# EAGLE design uhr (EAGLE 5.01)
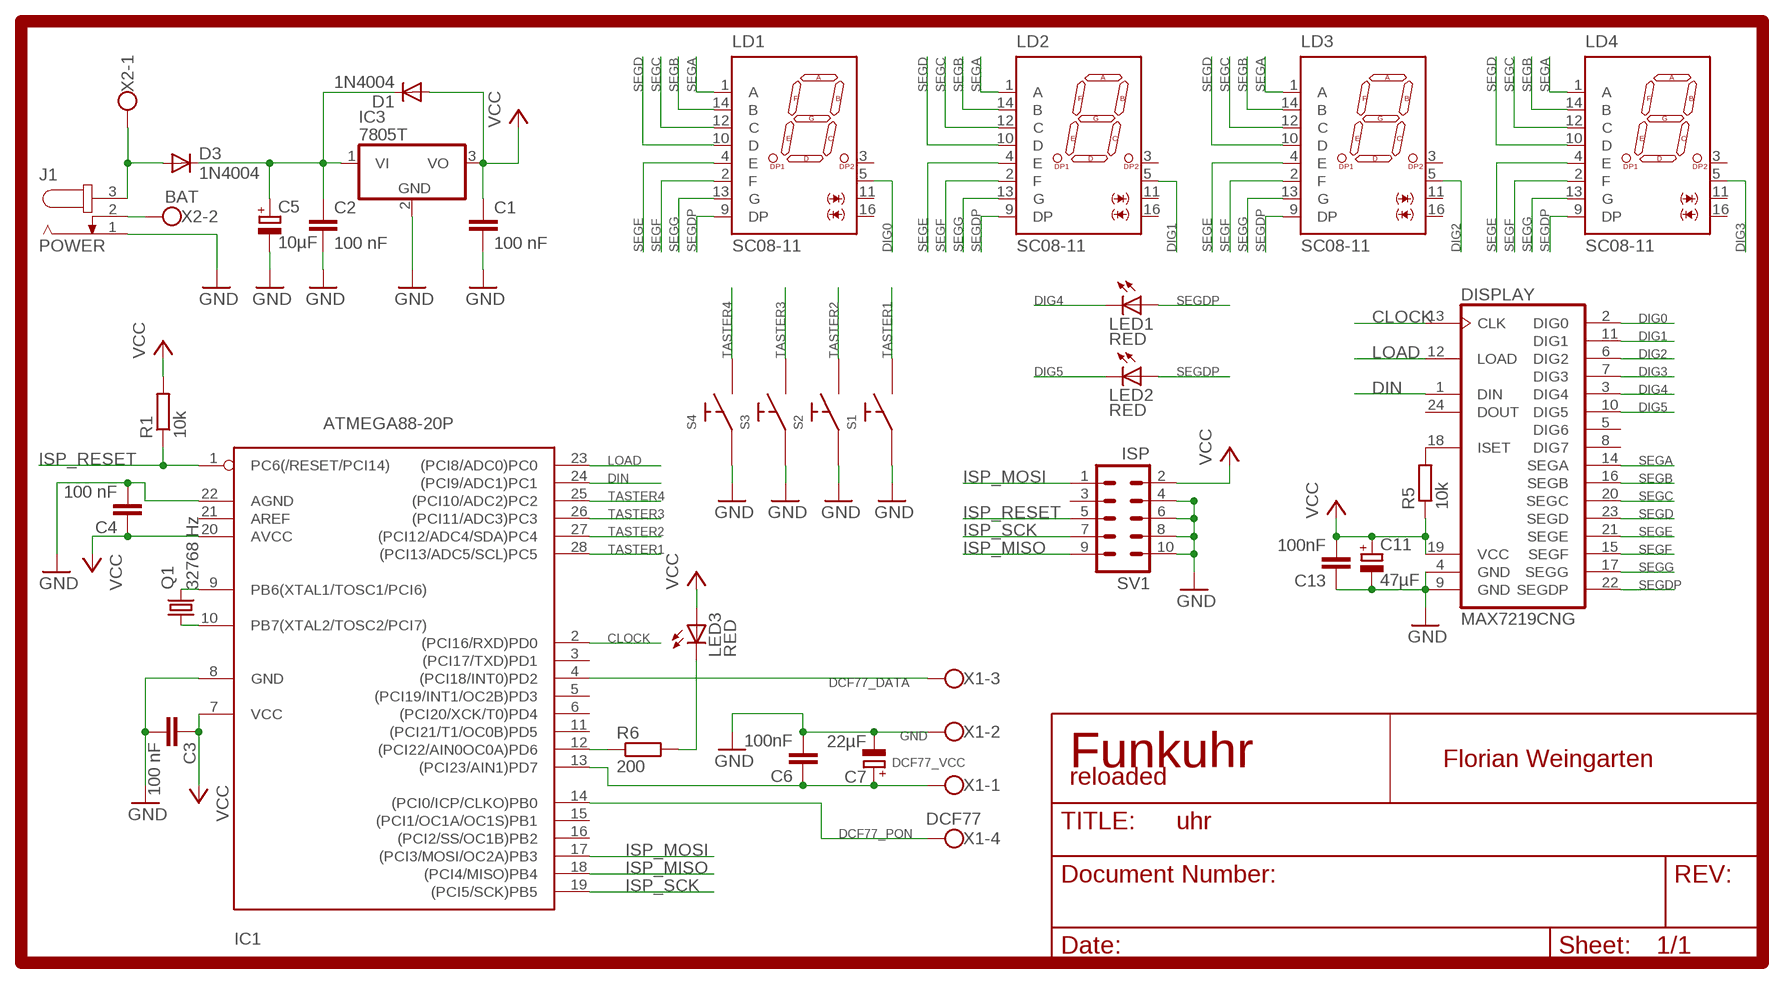
[diagram p0: schematic, sheet 1]

## Parts
C1  100 nF  C-EU025-024X044  [C025-024X044]
C2  100 nF  C-EU025-024X044  [C025-024X044]
C3  100 nF  C-EU025-024X044  [C025-024X044]
C4  100 nF  C-EU025-024X044  [C025-024X044]
C5  10µF  CPOL-EUE2-5  [E2-5]
C6  100nF  C-EU025-025X050  [C025-025X050]
C7  22µF  CPOL-EUE2,5-6E  [E2,5-6E]
C11  47µF  CPOL-EUE2-5  [E2-5]
C13  100nF  C-EU025-024X044  [C025-024X044]
D1  1N4004  DIODE-D-2.5  [D-2.5]
D3  1N4004  [DO41-10]
DISPLAY  MAX7219CNG  [DIL24-3]
IC1  ATMEGA88-20P  [DIL28-3]
IC3  7805T  [TO220H]
J1  POWER  JACK-PLUG1  [SPC4078]
LD1  SC08-11  [SA08]
LD2  SC08-11  [SA08]
LD3  SC08-11  [SA08]
LD4  SC08-11  [SA08]
LED1  RED  LED5MM  [LED5MM]
LED2  RED  LED5MM  [LED5MM]
LED3  RED  LED5MM  [LED5MM]
Q1  32768 Hz  CRYSTALTC26H  [TC26H]
R1  10k  R-EU_0207/10  [0207/10]
R5  10k  R-EU_0207/10  [0207/10]
R6  200  R-EU_0207/10  [0207/10]
S1  MIKROTASTER6X4H  [TASTER3305]
S2  MIKROTASTER6X4H  [TASTER3305]
S3  MIKROTASTER6X4H  [TASTER3305]
S4  MIKROTASTER6X4H  [TASTER3305]
SV1  ISP  ML10  [ML10]
X1  DCF77  W237-04P  [W237-4P]
X2  BAT  W237-102  [W237-102]

## Nets
CLOCK: DISPLAY.13(CLK) IC1.2((PCI16/RXD)PD0)
DCF77_DATA: IC1.4((PCI18/INT0)PD2) X1.3
DCF77_PON: IC1.14((PCI0/ICP/CLKO)PB0) X1.4
DCF77_VCC: C6.1 C7.+ IC1.13((PCI23/AIN1)PD7) X1.1
DIG0: DISPLAY.2(DIG0) LD1.5(AK)
DIG1: DISPLAY.11(DIG1) LD2.5(AK)
DIG2: DISPLAY.6(DIG2) LD3.5(AK)
DIG3: DISPLAY.7(DIG3) LD4.5(AK)
DIG4: DISPLAY.3(DIG4) LED1.K(C)
DIG5: DISPLAY.10(DIG5) LED2.K(C)
DIN: DISPLAY.1(DIN) IC1.24((PCI9/ADC1)PC1)
GND: C1.2 C2.2 C3.2 C4.2 C5.- C6.2 C7.- C11.- C13.1 DISPLAY.4(GND) DISPLAY.9(GND) IC1.8(GND) IC1.22(AGND) IC3.2(GND) J1.1 S1.1 S2.1 S3.1 S4.1 SV1.4 SV1.6 SV1.8 SV1.10 X1.2
ISP_MISO: IC1.18((PCI4/MISO)PB4) SV1.9
ISP_MOSI: IC1.17((PCI3/MOSI/OC2A)PB3) SV1.1
ISP_RESET: IC1.1(PC6(/RESET/PCI14)) R1.1 SV1.5
ISP_SCK: IC1.19((PCI5/SCK)PB5) SV1.7
LOAD: DISPLAY.12(LOAD) IC1.23((PCI8/ADC0)PC0)
N$1: IC1.9(PB6(XTAL1/TOSC1/PCI6)) Q1.2
N$2: DISPLAY.18(ISET) R5.2
N$3: IC1.10(PB7(XTAL2/TOSC2/PCI7)) Q1.1
N$6: IC1.12((PCI22/AIN0OC0A)PD6) R6.1
N$7: LED3.K(C) R6.2
N$12: C2.1 C5.+ D1.C D3.C IC3.1(VI)
N$18: J1.2 X2.2
N$20: D3.A J1.3 X2.1
SEGA: DISPLAY.14(SEGA) LD1.1(A) LD2.1(A) LD3.1(A) LD4.1(A)
SEGB: DISPLAY.16(SEGB) LD1.14(B) LD2.14(B) LD3.14(B) LD4.14(B)
SEGC: DISPLAY.20(SEGC) LD1.12(C) LD2.12(C) LD3.12(C) LD4.12(C)
SEGD: DISPLAY.23(SEGD) LD1.10(D) LD2.10(D) LD3.10(D) LD4.10(D)
SEGDP: DISPLAY.22(SEGDP) LD1.9(DP) LD2.9(DP) LD3.9(DP) LD4.9(DP) LED1.A LED2.A
SEGE: DISPLAY.21(SEGE) LD1.4(E) LD2.4(E) LD3.4(E) LD4.4(E)
SEGF: DISPLAY.15(SEGF) LD1.2(F) LD2.2(F) LD3.2(F) LD4.2(F)
SEGG: DISPLAY.17(SEGG) LD1.13(G) LD2.13(G) LD3.13(G) LD4.13(G)
TASTER1: IC1.28((PCI13/ADC5/SCL)PC5) S1.2
TASTER2: IC1.27((PCI12/ADC4/SDA)PC4) S2.2
TASTER3: IC1.26((PCI11/ADC3)PC3) S3.2
TASTER4: IC1.25((PCI10/ADC2)PC2) S4.2
VCC: C1.1 C3.1 C4.1 C11.+ C13.2 D1.A DISPLAY.19(VCC) IC1.7(VCC) IC1.20(AVCC) IC3.3(VO) LED3.A R1.2 R5.1 SV1.2
Unconnected: DISPLAY.5(DIG6) DISPLAY.8(DIG7) DISPLAY.24(DOUT) IC1.3((PCI17/TXD)PD1) IC1.5((PCI19/INT1/OC2B)PD3) IC1.6((PCI20/XCK/T0)PD4) IC1.11((PCI21/T1/OC0B)PD5) IC1.15((PCI1/OC1A/OC1S)PB1) IC1.16((PCI2/SS/OC1B)PB2) IC1.21(AREF) LD1.3(AK) LD1.11(AK) LD1.16(AK) LD2.3(AK) LD2.11(AK) LD2.16(AK) LD3.3(AK) LD3.11(AK) LD3.16(AK) LD4.3(AK) LD4.11(AK) LD4.16(AK) SV1.3

## Notes on the sheet
- Funkuhr | Florian Weingarten
- reloaded

## Library data of the parts
C1-C4 C6 C13 = rcl:C-EU: CAPACITOR, European symbol
C5 C7 C11 = rcl:CPOL-EU: POLARIZED CAPACITOR, European symbol
D1 = diode:DIODE-: DIODE
D3 = diode:1N4004: DIODE general purpose rectifier, 1 A
DISPLAY = maxim:MAX7219CNG: LED DISPLAY DRIVER
IC1 = avr:ATMEGA88*P: MICROCONTROLLER 8 kBytes FLASH 1 kBytes SRAM 512 Bytes EEPROM USART 8-channel 10 bit ADC
IC3 = linear:78*: Positive VOLTAGE REGULATOR Source: http://cache.national.com/ds/LM/LM78L05.pdf http://www.fairchildsemi.com/ds/LM/LM7805.pdf
J1 = con-jack:JACK-PLUG: DC POWER JACK Power Jack, DC, Right Angle, Through Hole, Rated 5A at 16VDC, PC Terminals Distributor: Farnell (www.Farnell.de) Drawing: 84N1161.pdf / 84N1162.pdf Manufacturer: SPC Technology (www.spctechnology.com) Type: SPC4077 / SPC 4078
LD1-LD4 = led:S*08: Kingbright 20mm (0.8Inch) Single Digit Numeric Display Source: SA08-11SRWA.pdf
LED1-LED3 = led:LED: LED OSRAM: - CHIPLED LG R971, LG N971, LY N971, LG Q971, LY Q971, LO R971, LY R971 LH N974, LH R974 LS Q976, LO Q976, LY Q976 LO Q996 - Hyper CHIPLED LW Q18S LB Q993, LB Q99A, LB R99A - SideLED LS A670, LO A670, LY A670, LG A670, LP A670 LB A673, LV A673, LT A673, LW A673 LH A674 LY A675 LS A676, LA A676, LO A676, LY A676, LW A676 LS A679, LY A679, LG A679 - Hyper Micro SIDELED® LS Y876, LA Y876, LO Y876, LY Y876 LT Y87S - SmartLED LW L88C, LW L88S LB L89C, LB L89S, LG L890 LS L89K, LO L89K, LY L89K LS L896, LA L896, LO L896, LY L896 - TOPLED LS T670, LO T670, LY T670, LG T670, LP T670 LSG T670, LSP T670, LSY T670, LOP T670, LYG T670 LG T671, LOG T671, LSG T671 LB T673, LV T673, LT T673, LW T673 LH T674 LS T676, LA T676, LO T676, LY T676, LB T676, LH T676, LSB T676, LW T676 LB T67C, LV T67C, LT T67C, LS T67K, LO T67K, LY T67K, LW E67C LS E67B, LA E67B, LO E67B, LY E67B, LB E67C, LV E67C, LT E67C LW T67C LS T679, LY T679, LG T679 LS T770, LO T770, LY T770, LG T770, LP T770 LB T773, LV T773, LT T773, LW T773 LH T774 LS E675, LA E675, LY E675, LS T675 LS T776, LA T776, LO T776, LY T776, LB T776 LHGB T686 LT T68C, LB T68C - Hyper Mini TOPLED® LB M676 - Mini TOPLED Santana® LG M470 LS M47K, LO M47K, LY M47K Source: http://www.osram.convergy.de - LUMILED® LXK2-PW12-R00, LXK2-PW12-S00, LXK2-PW14-U00, LXK2-PW14-V00 LXK2-PM12-R00, LXK2-PM12-S00, LXK2-PM14-U00 LXK2-PE12-Q00, LXK2-PE12-R00, LXK2-PE12-S00, LXK2-PE14-T00, LXK2-PE14-U00 LXK2-PB12-K00, LXK2-PB12-L00, LXK2-PB12-M00, LXK2-PB14-N00, LXK2-PB14-P00, LXK2-PB14-Q00 LXK2-PR12-L00, LXK2-PR12-M00, LXK2-PR14-Q00, LXK2-PR14-R00 LXK2-PD12-Q00, LXK2-PD12-R00, LXK2-PD12-S00 LXK2-PH12-R00, LXK2-PH12-S00 LXK2-PL12-P00, LXK2-PL12-Q00, LXK2-PL12-R00 Source: www.luxeon.com
Q1 = crystal:CRYSTAL: CRYSTAL
R1 R5 R6 = resistor:R-EU_: RESISTOR, European symbol
S1-S4 = reichelt:MIKROTASTER
SV1 = con-ml:ML10: HARTING
X1 = con-wago-508:W237-04P: WAGO SREW CLAMP
X2 = con-wago-500:W237-102: WAGO SCREW CLAMP

## Board
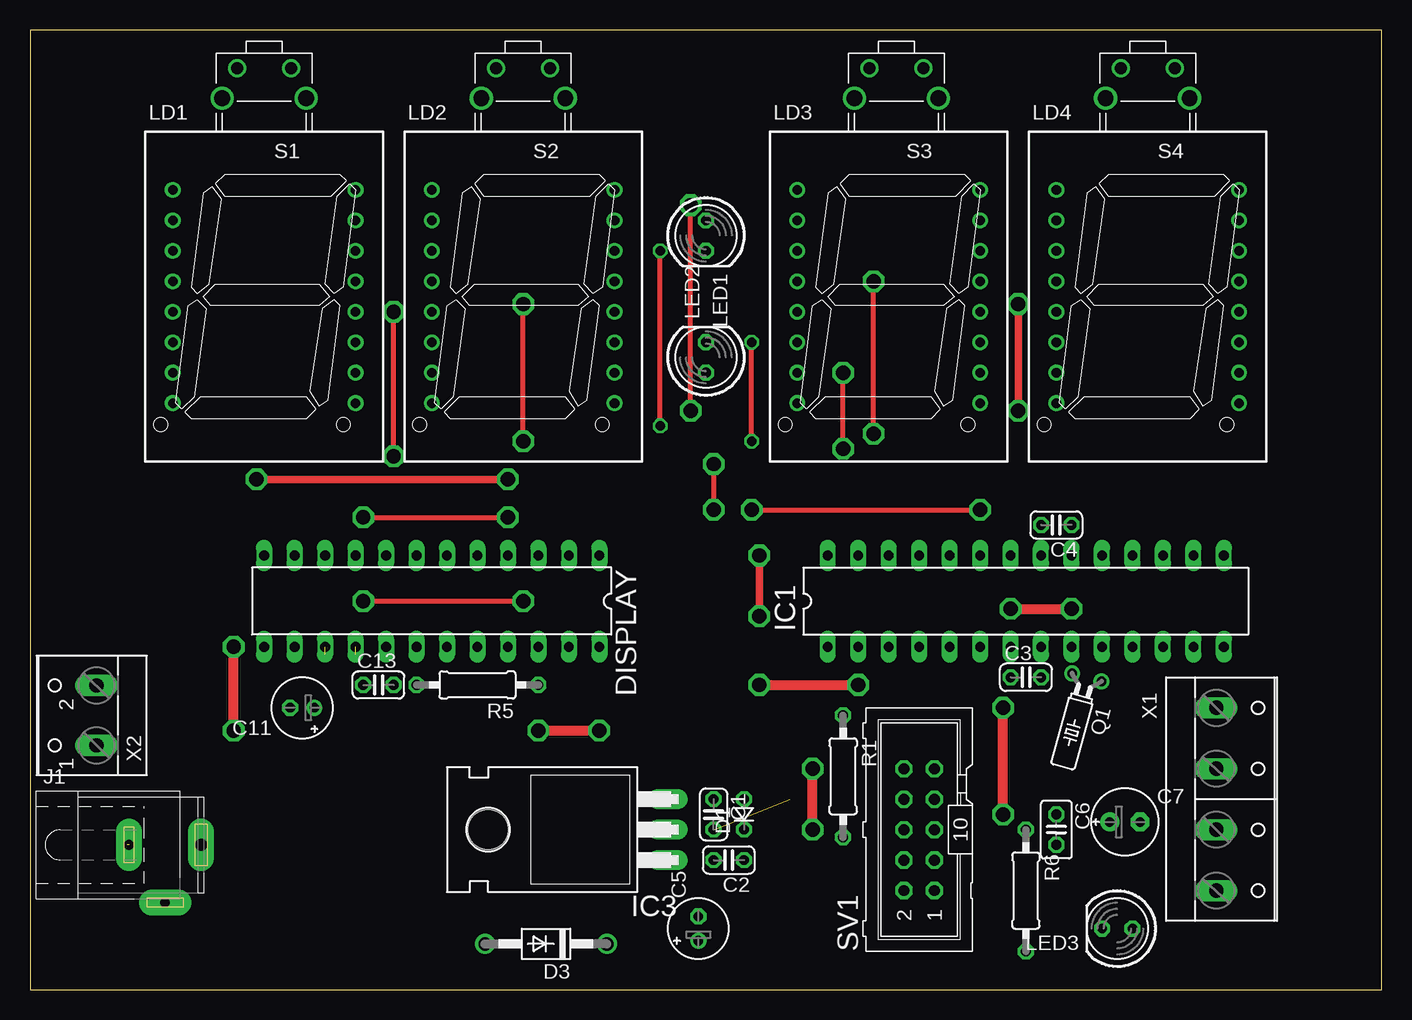
[diagram p1: board, top side]
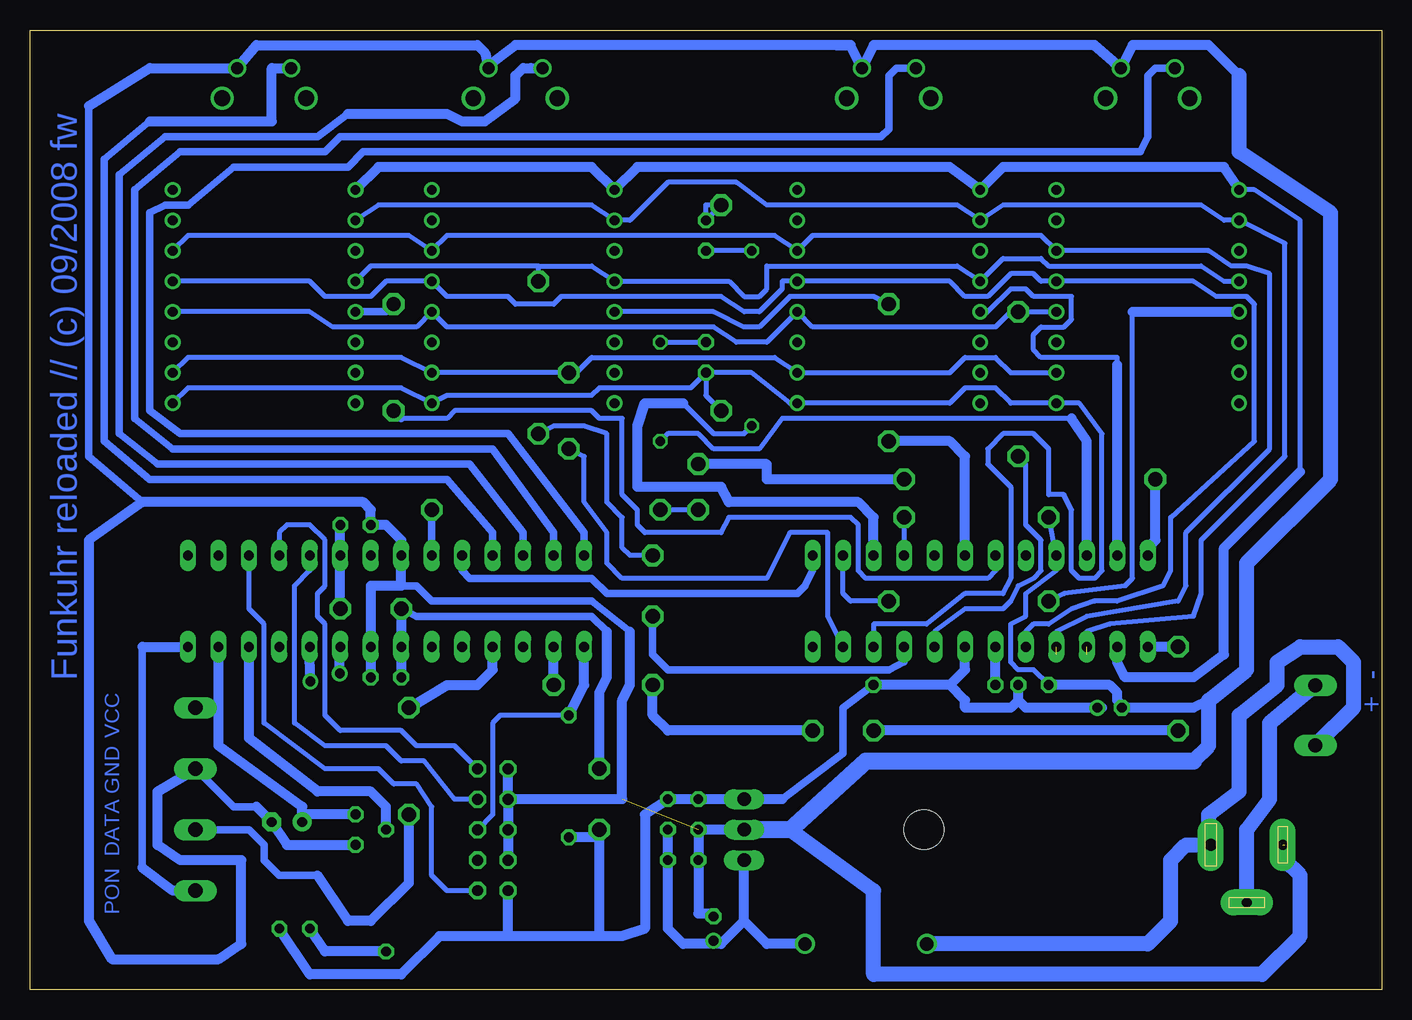
[diagram p2: board, bottom side, seen from below]

Size 112.7 x 80 mm. Coordinates in mm from the lower left corner, seen from the top.
Outline: 0,0 112.7,0 112.7,80 0,80 0,0
Copper layers (1*16): Top 0.035mm / dielectric 1.5mm / Bottom 0.035mm
Design rules "default": minimum track width 10mil, minimum drill 24mil, track to track 8mil, track to pad 8mil, pad to pad 8mil, via to via 8mil, smd to smd 8mil, copper to edge 40mil, drill to drill 8mil, minimum pad ring 10mil, minimum via ring 8mil, stop-mask expansion 4mil, vias tented up to drill 0mil, thermal gap 10mil

### Footprints (pad centres in the part's own frame; a part is rotated, then mirrored left to right if it is on the bottom)
C025-024X044 = drill 0.813 octagon: 1 -1.27,0; 2 1.27,0
E2-5 = drill 0.813 pad 1.27 round: + -1.016,0 | drill 0.813 pad 1.27 octagon: - 1.016,0
C025-025X050 = drill 0.813 octagon: 1 -1.27,0; 2 1.27,0
E2,5-6E = drill 0.813 pad 1.575 round: + -1.27,0 | drill 0.813 pad 1.575 octagon: - 1.27,0
D-2.5 = drill 0.813 octagon: A 1.27,0; C -1.27,0
DO41-10 = drill 1.118 round: A 5.08,0; C -5.08,0
DIL24-3 = drill 0.813 long: 1 -13.97,-3.81; 2 -11.43,-3.81; 3 -8.89,-3.81; 4 -6.35,-3.81; 5 -3.81,-3.81; 6 -1.27,-3.81; 7 1.27,-3.81; 8 3.81,-3.81; 9 6.35,-3.81; 10 8.89,-3.81; 11 11.43,-3.81; 12 13.97,-3.81; 13 13.97,3.81; 14 11.43,3.81; 15 8.89,3.81; 16 6.35,3.81; 17 3.81,3.81; 18 1.27,3.81; 19 -1.27,3.81; 20 -3.81,3.81; 21 -6.35,3.81; 22 -8.89,3.81; 23 -11.43,3.81; 24 -13.97,3.81
DIL28-3 = drill 0.813 long: 1 -16.51,-3.81; 2 -13.97,-3.81; 3 -11.43,-3.81; 4 -8.89,-3.81; 5 -6.35,-3.81; 6 -3.81,-3.81; 7 -1.27,-3.81; 8 1.27,-3.81; 9 3.81,-3.81; 10 6.35,-3.81; 11 8.89,-3.81; 12 11.43,-3.81; 13 13.97,-3.81; 14 16.51,-3.81; 15 16.51,3.81; 16 13.97,3.81; 17 11.43,3.81; 18 8.89,3.81; 19 6.35,3.81; 20 3.81,3.81; 21 1.27,3.81; 22 -1.27,3.81; 23 -3.81,3.81; 24 -6.35,3.81; 25 -8.89,3.81; 26 -11.43,3.81; 27 -13.97,3.81; 28 -16.51,3.81
TO220H = drill 1.118 long: 1 -2.54,-10.16; 2 0,-10.16; 3 2.54,-10.16 | hole 3.302: 0,4.826
SPC4078 = drill 0.8 pad 2.184 long: 1 -3,0; 2 0,-4.8 | drill 1 pad 2.184 long: 3 3,0
SA08 = drill 0.8 pad 1.27 round: 1 -7.62,8.89; 2 -7.62,6.35; 3 -7.62,3.81; 4 -7.62,1.27; 5 -7.62,-1.27; 6 -7.62,-3.81; 7 -7.62,-6.35; 8 -7.62,-8.89; 9 7.62,-8.89; 10 7.62,-6.35; 11 7.62,-3.81; 12 7.62,-1.27; 13 7.62,1.27; 14 7.62,3.81; 15 7.62,6.35; 16 7.62,8.89
LED5MM = drill 0.813 octagon: A -1.27,0; K 1.27,0
TC26H = drill 0.813 round: 1 -1.27,0; 2 1.27,0
0207/10 = drill 0.813 octagon: 1 -5.08,0; 2 5.08,0
TASTER3305 = drill 1 round: 1 -2.25,-1.25; 2 2.25,-1.25 | drill 1.3 round: 3 3.5,1.25; 4 -3.5,1.25
ML10 = drill 0.914 octagon: 1 -5.08,-1.27; 2 -5.08,1.27; 3 -2.54,-1.27; 4 -2.54,1.27; 5 0,-1.27; 6 0,1.27; 7 2.54,-1.27; 8 2.54,1.27; 9 5.08,-1.27; 10 5.08,1.27
W237-4P = drill 1.194 long: 1 -7.62,-0.635; 2 -2.54,-0.635; 3 2.54,-0.635; 4 7.62,-0.635
W237-102 = drill 1.194 long: 1 -2.5,-1.27; 2 2.5,-1.27

### Placement (x,y rotation side)
C1  56.98,14.6 270 top
C2  58.26,10.79 180 top
C3  83.02,26.03 0 top
C4  85.56,38.73 180 top
C5  55.71,5.08 90 top
C6  85.56,13.33 270 top
C7  91.28,13.97 0 top
C11  22.7,23.49 180 top
C13  29.04,25.39 0 top
D1  59.52,14.6 90 top
D3  43.02,3.8 180 top
DISPLAY  33.49,32.38 180 top
IC1  83.02,32.38 0 top
IC3  43.02,13.33 90 top
J1  11.27,12.06 0 top
LD1  19.52,57.78 0 top
LD2  41.11,57.78 0 top
LD3  71.59,57.78 0 top
LD4  93.18,57.78 0 top
LED1  56.35,62.86 270 top
LED2  56.35,52.7 90 top
LED3  90.64,5.08 180 top
Q1  88.1,26.03 164.8 top
R1  67.78,17.77 270 top
R5  37.3,25.39 180 top
R6  83.02,8.25 270 top
S1  19.52,75.56 180 top
S2  41.11,75.56 180 top
S3  72.23,75.56 180 top
S4  93.18,75.56 180 top
SV1  74.13,13.33 90 top
X1  99.53,15.87 270 top
X2  4.28,22.86 90 top

### Tracks (layer width: path | path; a pad name or v marks a point on that pad's centre or on a via)
CLOCK  (via drill 1.2 pad 0.61)
  Top 0.813: v16.98,21.58 v16.98,28.57 | v60.8,25.39 v69.05,25.39 | v42.38,21.58 v47.46,21.58
  Bottom 0.813: v69.05,25.39 IC1.2 | v16.98,21.58 v42.38,21.58 | v60.8,25.39 60.8,22.86 59.52,21.58 v47.46,21.58 | v16.98,28.57 DISPLAY.13
DCF77_DATA  (via drill 1.2 pad 1.78)
  Top 0.813: v81.12,14.6 v81.12,23.49
  Bottom 0.61: 88.73,9.52 91.91,9.52 93.18,10.79 93.18,12.06 94.45,13.33 X1.3
  Bottom 0.813: 88.73,9.52 86.2,5.71 84.29,5.71 81.12,8.89 v81.12,14.6 | v81.12,23.49 77.94,25.39 75.4,25.39 74.13,26.66 IC1.4
DCF77_PON
  Bottom 0.61: 103.34,10.16 103.34,28.57
  Bottom 0.813: 98.26,8.25 X1.4 100.8,8.25 103.34,10.16 | 103.34,28.57 IC1.14
DCF77_VCC
  Bottom 0.61: 96.99,23.49 X1.1
  Bottom 0.813: IC1.13 96.99,23.49 96.99,20.31 90.01,15.24 C7.+ 90.01,14.6 C6.1
DIG0  (via drill 1.2 pad 1.78)
  Top 0.406: v27.77,32.38 v41.11,32.38
  Bottom 0.406: DISPLAY.2 44.92,33.02 44.28,32.38 v41.11,32.38 | 20.79,56.51 20.79,34.29 21.43,33.65 26.5,33.02 v27.77,32.38
  Bottom 0.813: 20.79,56.51 LD1.5
DIG1
  Bottom 0.406: 22.06,52.07 22.06,52.7 28.41,52.7 29.04,53.34 29.04,54.61 28.41,55.24 26.5,55.24 25.87,55.88 25.87,57.78 29.04,57.78 29.68,58.41 30.95,58.41 32.86,56.51 LD2.5
  Bottom 0.813: DISPLAY.11 22.06,52.07
DIG2  (via drill 1.2 pad 0.61)
  Top 0.406: v41.11,45.72 v41.11,57.15
  Bottom 0.406: LD3.5 55.71,56.51 53.17,55.24 51.91,55.24 49.37,57.78 42.38,57.78 v41.11,57.15
  Bottom 0.813: v41.11,45.72 36.03,45.72 34.76,44.45 DISPLAY.6
DIG3  (via drill 1.2 pad 0.61)
  Top 0.61: v82.39,48.26 v82.39,57.15
  Bottom 0.406: DISPLAY.7 32.22,34.92 32.86,34.29 43.02,34.29 43.65,34.92 43.65,38.73 44.28,39.37 54.45,39.37 55.08,38.1 61.43,38.1 62.06,38.73 62.06,40 63.34,41.27 63.34,47.62 65.24,47.62 65.88,48.26 77.31,48.26 77.94,47.62 81.75,47.62
  Bottom 0.61: v82.39,57.15 83.02,56.51 LD4.5 | 81.75,47.62 v82.39,48.26
DIG4  (via drill 0.8)
  Top 0.406: v52.54,46.98 v52.54,61.59
  Bottom 0.406: 58.26,48.89 55.71,46.35 53.17,46.35 v52.54,46.98 | v52.54,61.59 LED1.K
  Bottom 0.813: DISPLAY.3 42.38,39.37 43.65,40.64 54.45,40.64 55.08,41.91 62.06,41.91 62.06,46.98 61.43,48.89 58.26,48.89
DIG5  (via drill 0.8)
  Top 0.406: v60.16,45.72 v60.16,53.97
  Bottom 0.406: v60.16,45.72 59.52,46.35 56.98,46.35 55.71,45.08 51.91,45.08 50,47.62 25.87,47.62 | v60.16,53.97 LED2.K
  Bottom 0.813: DISPLAY.10 24.6,45.72 25.87,47.62
DIN
  Bottom 0.61: IC1.24 76.67,34.92 76.04,34.29 65.88,34.29 64.61,33.02 48.73,33.02 48.09,33.65 47.46,34.92 DISPLAY.1
GND  (via drill 1.2 pad 0.61)  (2 unrouted)
  Top 0.406: v27.77,39.37 v39.84,39.37
  Bottom 0.254: 22.06,24.76 C11.- | 56.98,6.34 C5.- | IC3.2 53.81,13.97
  Bottom 0.406: C13.1 29.04,26.66 30.31,26.66 30.95,27.3 30.95,30.47 29.68,31.11 29.68,33.02 27.14,34.92 DISPLAY.9 v27.77,39.37 | v39.84,39.37 DISPLAY.4
  Bottom 0.61: 103.34,40.64 107.79,44.45 107.79,73.66 | 81.75,33.65 80.48,33.65 79.21,32.38 65.88,32.38 62.7,29.84 | 93.82,15.24 95.72,15.24 X1.2
  Bottom 0.813: C3.2 IC1.8 84.29,33.65 81.75,33.65 IC1.22 81.75,37.46 83.02,38.73 C4.2 84.29,40 84.93,40.64 103.34,40.64 107.79,37.46 107.79,5.71 105.88,2.54 96.99,2.54 95.09,3.8 95.09,10.79 100.17,10.79 102.07,12.06 102.07,16.5 X1.2 | 62.7,29.84 62.7,25.39 63.34,24.12 63.34,15.87 SV1.8 | 93.82,15.24 C7.- 91.28,12.06 C6.2 | C13.1 22.7,25.39 22.06,24.76 22.06,24.12 21.43,23.49 15.71,23.49 14.44,24.12 | 107.79,73.66 102.71,76.83 S4.1 93.82,78.73 75.4,78.73 74.77,78.1 S3.1 | IC3.2 C1.2 C2.2 56.98,6.34 55.71,6.34 | SV1.4 SV1.6 SV1.8 | SV1.8 SV1.10 | 44.28,78.73 S2.1 42.38,78.73 23.96,78.73 S1.1 20.79,78.73 14.44,78.73 11.9,76.19 | 74.77,76.83 72.23,78.73 44.28,78.73 | 45.55,78.73 44.28,78.73
  Bottom 1.27: 49.37,13.33 42.38,8.25 42.38,1.27 10,1.27 6.82,4.44 6.82,9.52 8.09,10.79 8.09,12.06 | 15.71,19.04 14.44,20.31 14.44,24.12 11.27,26.66 11.27,35.55 4.28,42.54 4.28,64.77 11.9,69.84 11.9,76.19
  Bottom 1.422: IC3.2 49.37,13.33 43.02,19.04 15.71,19.04
ISP_MISO
  Bottom 0.406: SV1.9 77.31,20.31 80.48,20.31 81.75,21.58 86.83,21.58 88.1,22.86 88.1,30.47 88.73,31.11 88.73,33.02 88.1,33.65 88.1,37.46 89.37,38.73 91.28,38.73 91.91,38.1 IC1.18
ISP_MOSI
  Bottom 0.406: SV1.1 77.94,8.25 79.21,9.52 79.21,15.24 80.48,17.14 82.39,17.14 83.66,18.41 88.1,18.41 93.18,22.22 93.18,30.47 94.45,31.74 IC1.17
ISP_RESET
  Bottom 0.406: SV1.5 74.13,14.6 74.13,22.22 73.5,22.86 R1.1
  Bottom 0.813: IC1.1 66.51,25.39 R1.1
ISP_SCK
  Bottom 0.406: SV1.7 77.31,15.87 79.85,19.04 81.75,19.04 83.02,20.31 88.1,20.31 90.64,22.22 90.64,33.65 89.37,34.92 IC1.19
LOAD  (via drill 1.2 pad 0.61)
  Top 0.406: v60.16,40 v79.21,40 | v56.98,43.81 v56.98,40
  Top 0.61: v18.89,42.54 v39.84,42.54
  Bottom 0.406: v56.98,40 v60.16,40
  Bottom 0.61: v79.21,40 IC1.23
  Bottom 0.813: v39.84,42.54 51.27,42.54 51.27,43.81 v56.98,43.81 | DISPLAY.12 19.52,36.83 18.89,37.46 v18.89,42.54
N$1
  Bottom 0.813: Q1.2 IC1.9
N$2
  Bottom 0.813: R5.2 DISPLAY.18
N$3
  Bottom 0.813: Q1.1 IC1.10
N$6
  Bottom 0.813: IC1.12 94.45,20.95 88.73,16.5 84.29,16.5 83.02,15.24 R6.1
N$7
  Bottom 0.813: LED3.K 88.1,3.17 R6.2
N$12
  Bottom 0.406: 55.71,3.8 C5.+
  Bottom 0.813: D1.C C2.1 59.52,5.08 58.26,3.8 55.71,3.8 55.08,3.8 53.17,5.71 | D3.C 51.27,3.8 53.17,5.71 | 53.17,5.71 IC3.1
N$18
  Bottom 1.27: J1.2 11.27,13.33 9.36,15.87 9.36,22.22 5.55,25.39 X2.2
N$20
  Bottom 1.27: 14.44,12.06 16.34,12.06 17.61,10.79 17.61,5.71 19.52,3.8 D3.A | X2.1 2.38,23.49 2.38,27.3 3.65,28.57 6.82,28.57 8.72,27.3 8.72,25.39 11.9,22.86 11.9,16.5 14.44,14.6 14.44,12.06 | 14.44,12.06 J1.3
SEGA
  Bottom 0.406: 6.82,43.18 6.82,64.13 10.63,66.67 LD1.1
  Bottom 0.813: LD1.1 13.17,68.57 31.59,68.57 LD2.1 36.03,68.57 62.06,68.57 LD3.1 65.88,68.57 83.66,68.57 LD4.1 | 6.82,43.18 13.17,36.83 13.17,27.93 15.71,26.03 21.43,26.03 22.06,27.3 DISPLAY.14
SEGB  (1 unrouted)
  Bottom 0.406: LD4.14 99.53,62.86 81.12,62.86 LD3.14 77.94,62.86 50.63,62.86 LD2.14 47.46,62.86 28.41,62.86 LD1.14 14.44,61.59 12.54,60.32 11.27,60.32 9.36,59.69 9.36,45.08 16.34,38.1 16.34,33.65 16.98,32.38 24.6,31.11 27.14,29.84 27.14,27.93
SEGC  (via drill 1.2 pad 1.78)
  Top 0.406: v30.31,44.45 v30.31,56.51
  Bottom 0.406: LD1.12 v30.31,56.51 30.95,56.51 32.22,55.24 47.46,55.24 LD2.12 51.27,53.97 53.81,53.97 55.71,55.24 77.94,55.24 LD3.12 80.48,55.24 87.47,55.24 89.37,56.51 LD4.12 | DISPLAY.20 37.3,29.84 34.76,31.74 31.59,31.74 30.95,32.38 30.31,33.65 29.04,34.29 28.41,34.92 28.41,37.46 29.68,38.73 29.68,43.81 v30.31,44.45
SEGD  (via drill 1.2 pad 0.61)
  Top 0.406: v67.78,45.08 v67.78,51.43
  Bottom 0.406: LD1.10 30.95,51.43 32.22,52.7 34.76,52.7 36.03,51.43 LD2.10 50.63,52.7 65.88,52.7 67.14,51.43 v67.78,51.43 LD3.10 81.75,52.7 99.53,52.7 LD4.10 | DISPLAY.23 46.19,31.11 46.19,38.1 49.37,38.1 51.27,34.29 63.34,34.29 64.61,35.55 64.61,38.1 66.51,40.64 66.51,44.45 v67.78,45.08
SEGDP  (via drill 1.2 pad 1.78)
  Top 0.406: v55.08,48.26 v55.08,65.4
  Bottom 0.406: LD4.9 99.53,50.16 81.75,50.16 LD3.9 77.94,49.53 65.88,49.53 65.24,50.16 57.62,50.16 LED2.A | LED2.A 52.54,51.43 49.37,48.89 LD2.9 36.03,48.89 34.76,50.16 32.22,50.16 30.95,48.89 LD1.9 25.23,48.89 23.33,46.35 23.33,34.92 23.96,34.29 25.23,34.29 25.87,34.92 25.87,40 26.5,41.27 27.77,41.27 27.77,45.08 29.04,46.35 31.59,46.35 32.86,45.08 32.86,43.81 30.95,41.91 30.95,34.29 31.59,33.02 34.76,33.02 37.94,30.47 42.38,30.47 DISPLAY.22 | v55.08,48.26 56.35,49.53 LED2.A | v55.08,65.4 LED1.A 56.35,65.4 v55.08,65.4
SEGE  (via drill 1.2 pad 0.61)
  Top 0.406: v70.32,46.35 v70.32,59.05
  Top 0.61: v60.8,31.11 v60.8,36.19
  Bottom 0.406: LD1.4 13.17,59.05 15.07,60.32 27.77,60.32 28.41,60.96 31.59,60.96 LD2.4 35.4,60.32 51.27,60.32 51.27,58.41 51.91,57.78 53.17,57.78 54.45,59.05 LD3.4 65.88,60.32 70.32,60.32 | 70.32,60.32 84.29,60.32 LD4.4 | v70.32,59.05 70.32,60.32 | v70.32,46.35 69.05,46.98 66.51,46.98 64.61,46.35 64.61,40.64 63.34,39.37 63.34,36.83 62.7,36.19 v60.8,36.19
  Bottom 0.61: DISPLAY.21 39.84,27.3 41.11,26.66 59.52,26.66 60.8,27.93 v60.8,31.11
SEGF  (1 unrouted)
  Bottom 0.406: LD4.2 83.66,65.4 65.88,65.4 LD3.2 62.7,64.13 59.52,67.3 53.81,67.3 51.27,65.4 35.4,65.4 LD2.2 31.59,65.4 15.07,65.4 13.17,64.13 LD1.2 8.09,62.23 8.09,44.45 15.07,37.46 15.07,33.02 15.71,31.11 22.7,30.47 24.6,29.84 24.6,27.93
SEGG
  Bottom 0.406: LD4.13 89.37,59.05 88.1,57.78 84.29,57.78 83.02,59.05 LD3.13 77.94,57.78 72.86,57.78 72.23,57.15 69.05,57.15 68.42,57.78 55.08,57.78 53.17,56.51 51.91,56.51 50,58.41 50,59.05 LD2.13 36.03,59.05 34.76,57.78 32.86,57.78 30.95,59.69 29.04,59.69 28.41,59.05 LD1.13 15.71,59.05 13.8,57.78 11.27,57.78 10.63,57.15 10.63,45.72 17.61,39.37 17.61,34.92 18.25,33.65 22.06,32.38 23.96,32.38 25.87,31.74 27.77,30.47 29.04,30.47 29.68,29.84 DISPLAY.17
TASTER1
  Bottom 0.61: IC1.28 66.51,38.1 72.86,46.35 100.17,46.35 102.71,48.26 102.71,64.77 101.44,65.4 99.53,65.4 95.72,68.57 86.2,68.57 84.93,69.84 20.16,69.84 19.52,71.11 19.52,76.19 18.89,76.83 S1.2
TASTER2
  Bottom 0.61: IC1.27 69.05,38.1 74.13,45.08 100.8,45.08 103.98,47.62 103.98,66.67 100.17,69.84 88.1,69.84 86.83,71.11 41.74,71.11 41.11,71.75 41.11,76.19 40.48,76.83 S2.2
TASTER3
  Bottom 0.61: IC1.26 71.59,38.1 76.04,43.81 102.07,43.81 105.25,46.35 105.25,67.94 101.44,71.11 88.73,71.11 86.2,73.02
  Bottom 0.813: 86.2,73.02 77.94,73.02 76.67,72.38 74.77,72.38 72.23,74.29 72.23,76.19 71.59,76.83 70.96,76.83 | 70.96,76.83 70.32,76.83 | 70.96,76.83 S3.2
TASTER4
  Bottom 0.61: IC1.25 74.13,38.1 77.94,42.54 102.71,42.54 106.52,45.72 106.52,69.21 102.71,72.38
  Bottom 0.813: 102.71,72.38 92.55,72.38 92.55,76.83 S4.2
VCC  (via drill 1.2 pad 1.78)
  Top 0.813: v65.24,13.33 v65.24,18.41 | v81.75,31.74 v86.83,31.74
  Bottom 0.254: 23.96,23.49 C11.+ 23.33,23.49 | v81.75,31.74 81.75,31.11
  Bottom 0.61: 64.61,29.84 65.88,31.11 80.48,31.11 v81.75,31.74 | 50,15.87 44.92,19.68 44.92,23.49 R5.1
  Bottom 0.813: C3.1 IC1.7 81.75,31.11 | LED3.A 89.37,1.27 81.75,1.27 78.58,4.44 72.86,4.44 | 65.24,4.44 72.86,4.44 | C4.1 IC1.20 v86.83,31.74 | 64.61,29.84 64.61,26.03 65.24,24.76 v65.24,18.41 | 36.03,25.39 34.76,26.66 DISPLAY.19 | 36.03,25.39 34.76,24.12 34.76,23.49 30.95,23.49 30.31,24.12 | 30.31,24.12 C13.2 | 23.33,23.49 23.96,23.49 29.68,23.49 30.31,24.12 | 65.24,4.44 65.24,12.7 | 65.24,12.7 v65.24,13.33 | 65.24,4.44 63.34,4.44 61.43,5.08 61.43,14.6 D1.A C1.1 IC3.3 50,15.87 | 72.86,4.44 SV1.2 | 36.03,25.39 R5.1 | 65.24,12.7 R1.2

### Text on the board
Bottom: Funkuhr reloaded // (c) 09/2008 fw | + - | VCC | GND | DATA | PON